# Altium schematic sheet PIXRACER-FMU-R12.SchDoc
size A4
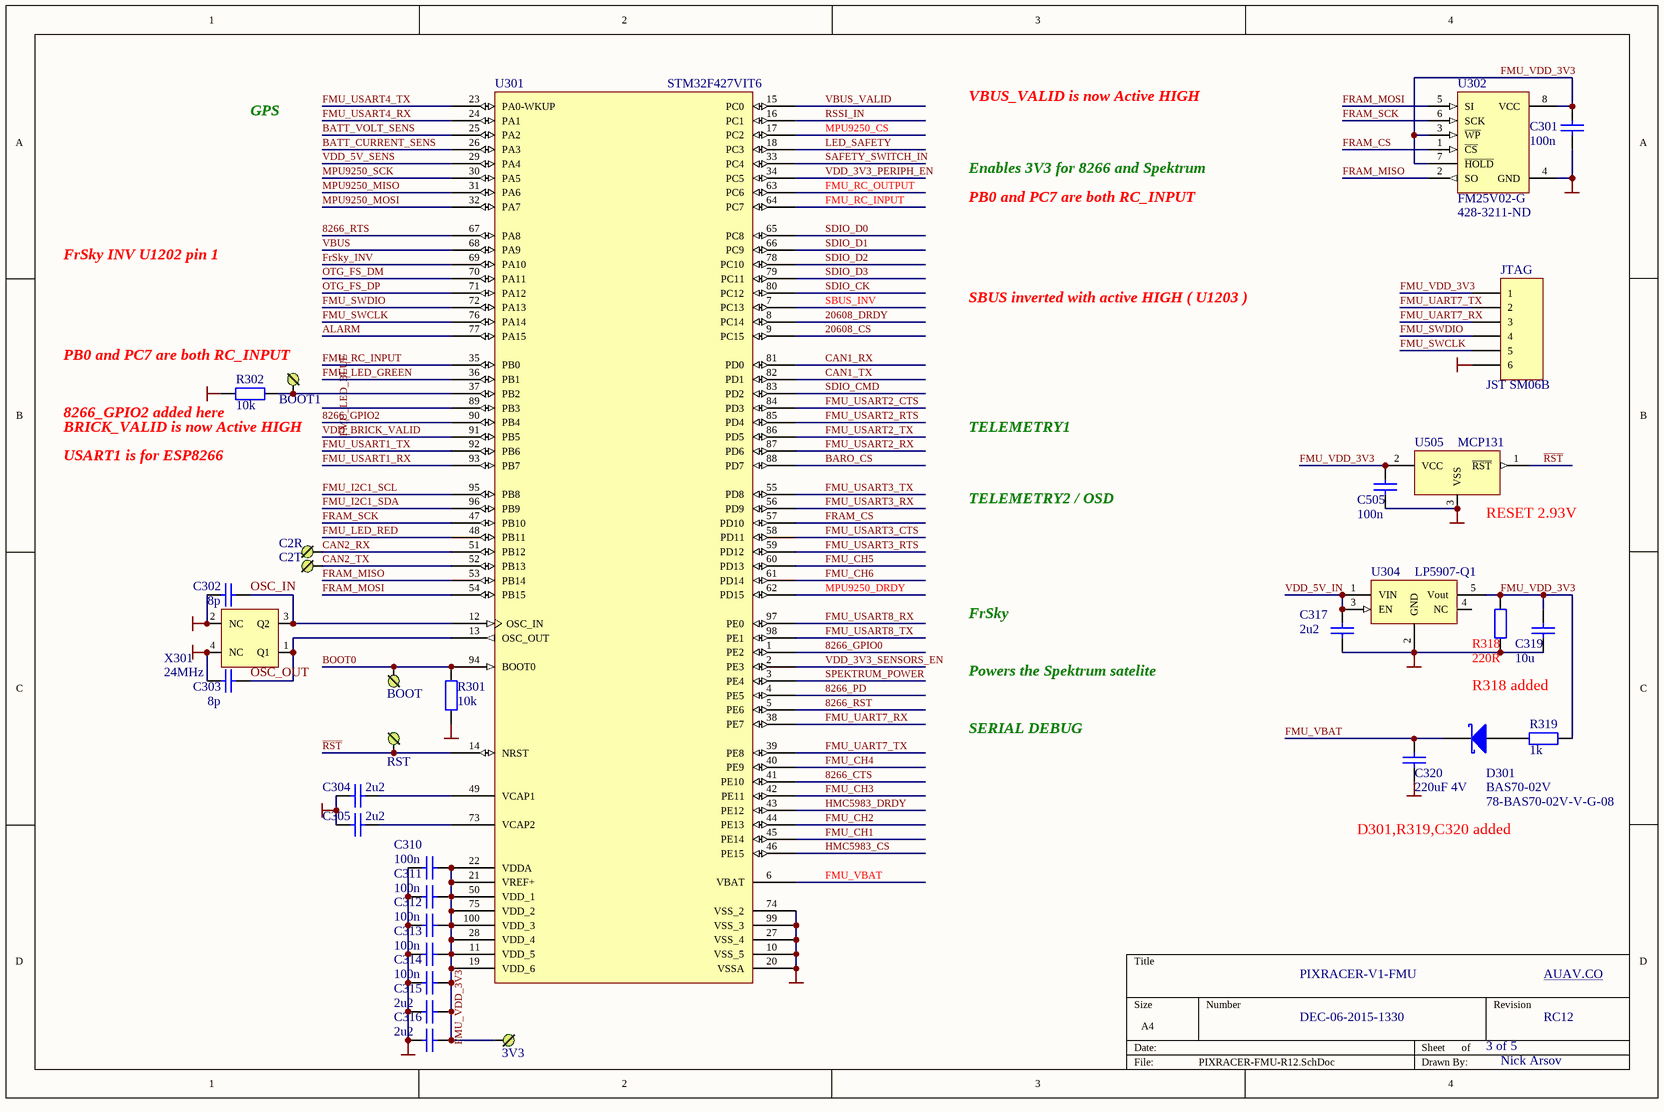
[diagram p0: PIXRACER-FMU-R12.SchDoc]

## Parts
3V3  3V3  [PAD1]  (value not drawn)
BOOT  BOOT  [PAD1]  (value not drawn)
BOOT1  BOOT1  [PAD1]  (value not drawn)
C2R  CAN2_RX  [PAD1]  (value not drawn)
C2T  CAN2_TX  [PAD1]  (value not drawn)
C301  100n  [0402A]
C302  8p  [0603A]
C303  8p  [0603A]
C304  2u2  [0402A]
C305  2u2  [0402A]
C310  100n  [0402A]
C311  100n  [0402A]
C312  100n  [0402A]
C313  100n  [0402A]
C314  100n  [0402A]
C315  2u2  [0402A]
C316  2u2  [0402A]
C317  2u2  [0603A]
C319  10u  [0603A]
C320  220uF 4V  [1206A]
C505  100n  [0402A]
D301  BAS70-02V  Mouser: 78-BAS70-02V-V-G-08  [SOD-523]
JTAG  JST SM06B  [SM06B-SRSH-TB]
R301  10k  [0402A]
R302  10k  [0402A]
R318  220R  [0603A]
R319  1k  [0603A]
RST  BOOT  [PAD1]  (value not drawn)
U301  STM32F427VIT6  [LQFP100_L]
U302  FM25V02-G  Supplier Part Number: 428-3211-ND  [SO-8_N]
U304  LP5907-Q1  [SOT23-5]
U505  MCP131  [SOT-323]
X301  24MHz  [Crystal_2.5x2]

## Nets
GND: C301.1 C302.1 C303.1 C304.2 C305.2 C310.1 C311.1 C312.1 C313.1 C314.1 C315.1 C316.1 C317.1 C319.1 C320.1 C505.1 JTAG.6 R301.2 R302.1 R318.1 U301.10(VSS_5) U301.20(VSSA) U301.27(VSS_4) U301.74(VSS_2) U301.99(VSS_3) U302.4(GND) U304.2(GND) U505.3(VSS) X301.2(NC) X301.4(NC)
8266_CTS: U301.41(PE10)
8266_GPIO0: U301.1(PE2)
8266_GPIO2: U301.90(PB4)
8266_PD: U301.4(PE5)
8266_RST: U301.5(PE6)
8266_RTS: U301.67(PA8)
20608_CS: U301.9(PC15)
20608_DRDY: U301.8(PC14)
~{RST}: RST.1 U301.14(NRST) U505.1(~{RST})
ALARM: U301.77(PA15)
BARO_CS: U301.88(PD7)
BATT_CURRENT_SENS: U301.26(PA3)
BATT_VOLT_SENS: U301.25(PA2)
BOOT0: BOOT.1 R301.1 U301.94(BOOT0)
CAN1_RX: U301.81(PD0)
CAN1_TX: U301.82(PD1)
CAN2_RX: C2R.1 U301.51(PB12)
CAN2_TX: C2T.1 U301.52(PB13)
FMU_CH1: U301.45(PE14)
FMU_CH2: U301.44(PE13)
FMU_CH3: U301.42(PE11)
FMU_CH4: U301.40(PE9)
FMU_CH5: U301.60(PD13)
FMU_CH6: U301.61(PD14)
FMU_I2C1_SCL: U301.95(PB8)
FMU_I2C1_SDA: U301.96(PB9)
FMU_LED_BLUE: U301.91(PB5)  [also labelled VDD_BRICK_VALID]
FMU_LED_GREEN: U301.36(PB1)
FMU_LED_RED: U301.48(PB11)
FMU_RC_INPUT: U301.35(PB0) U301.64(PC7)
FMU_RC_OUTPUT: U301.63(PC6)
FMU_SWCLK: JTAG.5 U301.76(PA14)
FMU_SWDIO: JTAG.4 U301.72(PA13)
FMU_UART7_RX: JTAG.3 U301.38(PE7)
FMU_UART7_TX: JTAG.2 U301.39(PE8)
FMU_USART1_RX: U301.93(PB7)
FMU_USART1_TX: U301.92(PB6)
FMU_USART2_CTS: U301.84(PD3)
FMU_USART2_RTS: U301.85(PD4)
FMU_USART2_RX: U301.87(PD6)
FMU_USART2_TX: U301.86(PD5)
FMU_USART3_CTS: U301.58(PD11)
FMU_USART3_RTS: U301.59(PD12)
FMU_USART3_RX: U301.56(PD9)
FMU_USART3_TX: U301.55(PD8)
FMU_USART4_RX: U301.24(PA1)
FMU_USART4_TX: U301.23(PA0-WKUP)
FMU_USART8_RX: U301.97(PE0)
FMU_USART8_TX: U301.98(PE1)
FMU_VBAT: C320.2 D301.2(K) U301.6(VBAT)
FMU_VDD_3V3: 3V3.1 C301.2 C310.2 C311.2 C312.2 C313.2 C314.2 C315.2 C316.2 C319.2 C505.2 JTAG.1 R318.2 R319.1 U301.11(VDD_5) U301.19(VDD_6) U301.21(VREF+) U301.22(VDDA) U301.28(VDD_4) U301.50(VDD_1) U301.75(VDD_2) U301.100(VDD_3) U302.3(~{WP}) U302.7(~{HOLD}) U302.8(VCC) U304.5(Vout) U505.2(VCC)
FRAM_CS: U301.57(PD10) U302.1(~{CS})
FRAM_MISO: U301.53(PB14) U302.2(SO)
FRAM_MOSI: U301.54(PB15) U302.5(SI)
FRAM_SCK: U301.47(PB10) U302.6(SCK)
FrSky_INV: U301.69(PA10)
HMC5983_CS: U301.46(PE15)
HMC5983_DRDY: U301.43(PE12)
LED_SAFETY: U301.18(PC3)
MPU9250_CS: U301.17(PC2)
MPU9250_DRDY: U301.62(PD15)
MPU9250_MISO: U301.31(PA6)
MPU9250_MOSI: U301.32(PA7)
MPU9250_SCK: U301.30(PA5)
OSC_IN: C302.2 U301.12(OSC_IN) X301.3(Q2)
OSC_OUT: C303.2 U301.13(OSC_OUT) X301.1(Q1)
OTG_FS_DM: U301.70(PA11)
OTG_FS_DP: U301.71(PA12)
RSSI_IN: U301.16(PC1)
SAFETY_SWITCH_IN: U301.33(PC4)
SBUS_INV: U301.7(PC13)
SDIO_CK: U301.80(PC12)
SDIO_CMD: U301.83(PD2)
SDIO_D0: U301.65(PC8)
SDIO_D1: U301.66(PC9)
SDIO_D2: U301.78(PC10)
SDIO_D3: U301.79(PC11)
SPEKTRUM_POWER: U301.3(PE4)
VBUS: U301.68(PA9)
VBUS_VALID: U301.15(PC0)
VDD_3V3_PERIPH_EN: U301.34(PC5)
VDD_3V3_SENSORS_EN: U301.2(PE3)
VDD_5V_IN: C317.2 U304.1(VIN) U304.3(EN)
VDD_5V_SENS: U301.29(PA4)
NetBOOT1_1: BOOT1.1 R302.2 U301.37(PB2)
NetC304_1: C304.1 U301.49(VCAP1)
NetC305_1: C305.1 U301.73(VCAP2)
NetD301_1: D301.1(A) R319.2

Not connected (* = marked no-connect by the designer): U301 89(PB3); U304 4(NC)

## Notes on the sheet
- GPS
- VBUS_VALID is now Active HIGH
- Enables 3V3 for 8266 and Spektrum
- FrSky INV U1202 pin 1
- PB0 and PC7 are both RC_INPUT
- SBUS inverted with active HIGH ( U1203 )
- (near BOOT1) PB0 and PC7 are both RC_INPUT
- (near R302) USART1 is for ESP8266
- BRICK_VALID is now Active HIGH
- (near R302) 8266_GPIO2 added here
- TELEMETRY1
- TELEMETRY2 / OSD
- (near U505) RESET 2.93V
- FrSky
- Powers the Spektrum satelite
- R318 added
- SERIAL DEBUG
- D301,R319,C320 added
- PIXRACER-V1-FMU
- AUAV.CO
- DEC-06-2015-1330
- 3 of 5
- RC12
- Nick Arsov

## Library data of the parts
3V3 BOOT BOOT1 C2R C2T RST = PLUG
C301-C305 C310-C317 C319 C320 C505 = Cap: Capacitor; Value: 100pF; Published: 8-Jun-2000; LatestRevisionDate: 17-Jul-2002; LatestRevisionNote: Re-released for DXP Platform.; PackageReference: RAD-0.3; Publisher: Altium Limited
  C320: PackageDescription: Radial Cap, Thru-Hole; 2 Leads; 0.3 in Pin Spacing
D301 = D Schottky: Schottky Diode; Published: 8-Jun-2000; LatestRevisionDate: 17-Jul-2002; LatestRevisionNote: Re-released for DXP Platform.; PackageReference: SMB; Publisher: Altium Limited; PackageDescription: DO-214-AA/SMB; 2 C-Bend Leads; Body 5.3 x 3.6 mm, inc. leads (LxW); Code_JEDEC: DO-214-AA
JTAG = Header 6: Header, 6-Pin; LatestRevisionDate: 17-Jul-2002; LatestRevisionNote: Re-released for DXP Platform.; Publisher: Altium Limited
R301 R302 R318 = Res2: Resistor; Value: 1K; Published: 8-Jun-2000; LatestRevisionDate: 17-Jul-2002; LatestRevisionNote: Re-released for DXP Platform.; PackageReference: AXIAL-0.4; Publisher: Altium Limited; PackageDescription: Axial Device, Thru-Hole; 2 Leads; 0.4 in Pin Spacing
R319 = Res2: Resistor; Published: 8-Jun-2000; LatestRevisionDate: 17-Jul-2002; LatestRevisionNote: Re-released for DXP Platform.; PackageReference: AXIAL-0.4; Publisher: Altium Limited; PackageDescription: Axial Device, Thru-Hole; 2 Leads; 0.4 in Pin Spacing; Value: 1K
U301 = STM32F103VBT6: STM32 ARM-based 32-bit MCU with 64 Kbytes Flash, 100-pin LQFP, Industrial Temperature; Published: 30-May-2008; DatasheetVersion: rev6, Mar-2008; PackageVersion: Mar-2008; PackageReference: LQFP100; Publisher: Altium Limited; PackageDescription: 100-Pin Low-Profile Quad Flat Pack, 14 x 14 mm Body, 0.5 mm Pitch (LQFP100); ComponentLink1Description: Manufacturer Link; ComponentLink1URL: www.st.com/stm32; ComponentLink2Description: Datasheet; ComponentLink2URL: http://www.st.com/stonline/products/literature/ds/13587.pdf
U302 = AT45DB161D-MU
U505 = MCP102
X301 = Crystal_4pin: Supplier Part Number: 644-1052-1-ND